# Altium schematic sheet Fan Control Module.SchDoc
size A
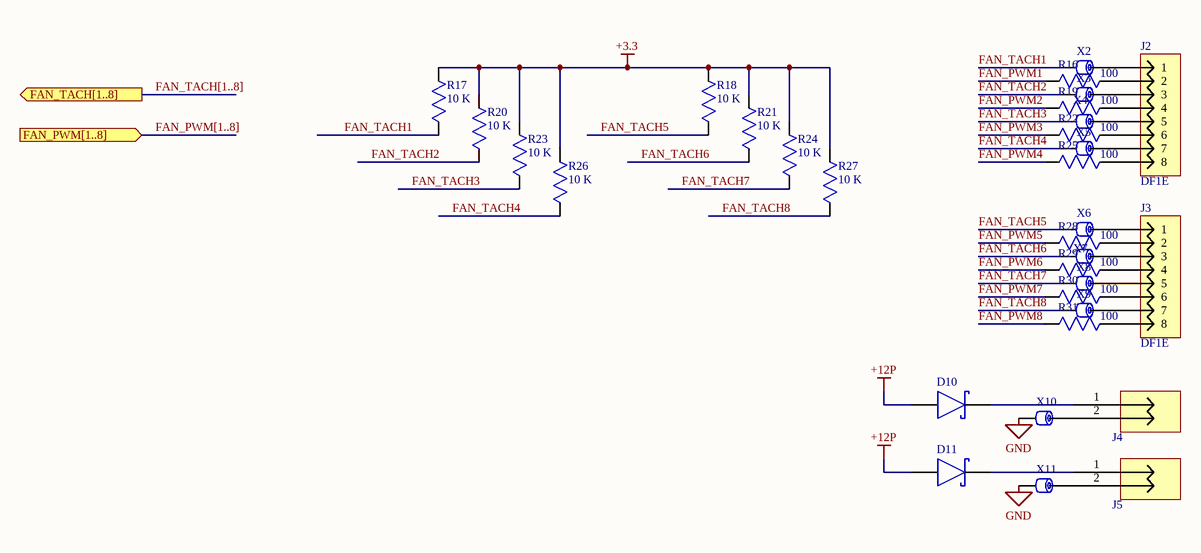
[diagram p0: Fan Control Module.SchDoc]

## Parts
D10  STPS20L15G-TR  [D2PAK-D]  (value not drawn)
D11  STPS20L15G-TR  [D2PAK-D]  (value not drawn)
J2  value DF1E  [DF1EC-8P-2.5DSA]  (hidden comment: DF1E 5-pin Male Header)
J3  value DF1E  [DF1EC-8P-2.5DSA]  (hidden comment: DF1E 5-pin Male Header)
J4  J_PHOENIX_2M_5.08  [PHX2UP]  (value not drawn)
J5  J_PHOENIX_2M_5.08  [PHX2UP]  (value not drawn)
R16  value 100  [0603_res]  (hidden comment: RES 0603)
R17  value 10 K  [0603_res]  (hidden comment: RES 0603)
R18  value 10 K  [0603_res]  (hidden comment: RES 0603)
R19  value 100  [0603_res]  (hidden comment: RES 0603)
R20  value 10 K  [0603_res]  (hidden comment: RES 0603)
R21  value 10 K  [0603_res]  (hidden comment: RES 0603)
R22  value 100  [0603_res]  (hidden comment: RES 0603)
R23  value 10 K  [0603_res]  (hidden comment: RES 0603)
R24  value 10 K  [0603_res]  (hidden comment: RES 0603)
R25  value 100  [0603_res]  (hidden comment: RES 0603)
R26  value 10 K  [0603_res]  (hidden comment: RES 0603)
R27  value 10 K  [0603_res]  (hidden comment: RES 0603)
R28  value 100  [0603_res]  (hidden comment: RES 0603)
R29  value 100  [0603_res]  (hidden comment: RES 0603)
R30  value 100  [0603_res]  (hidden comment: RES 0603)
R31  value 100  [0603_res]  (hidden comment: RES 0603)
X2  0603  [0603_res]  (value not drawn)
X3  0603  [0603_res]  (value not drawn)
X4  0603  [0603_res]  (value not drawn)
X5  0603  [0603_res]  (value not drawn)
X6  0603  [0603_res]  (value not drawn)
X7  0603  [0603_res]  (value not drawn)
X8  0603  [0603_res]  (value not drawn)
X9  0603  [0603_res]  (value not drawn)
X10  Ferrite Bead  [28F0181-1SR-10]  (value not drawn)
X11  Ferrite Bead  [28F0181-1SR-10]  (value not drawn)

## Ports
FAN_PWM[1..8] (in), FAN_TACH[1..8] (out)

## Nets
+3.3: R17.1 R18.1 R20.1 R21.1 R23.1 R24.1 R26.1 R27.1
+12P: D10.A D11.A
GND: X10.1 X11.1
FAN_PWM1: R16.2
FAN_PWM2: R19.2
FAN_PWM3: R22.2
FAN_PWM4: R25.2
FAN_PWM5: R28.2
FAN_PWM6: R29.2
FAN_PWM7: R30.2
FAN_PWM8: R31.2
FAN_TACH1: R17.2 X2.1
FAN_TACH2: R20.2 X3.1
FAN_TACH3: R23.2 X4.1
FAN_TACH4: R26.2 X5.1
FAN_TACH5: R18.2 X6.1
FAN_TACH6: R21.2 X7.1
FAN_TACH7: R24.2 X8.1
FAN_TACH8: R27.2 X9.1
NetD10_K: D10.K J4.1
NetD11_K: D11.K J5.1
NetJ2_1: J2.1 X2.2
NetJ2_2: J2.2 R16.1
NetJ2_3: J2.3 X3.2
NetJ2_4: J2.4 R19.1
NetJ2_5: J2.5 X4.2
NetJ2_6: J2.6 R22.1
NetJ2_7: J2.7 X5.2
NetJ2_8: J2.8 R25.1
NetJ3_1: J3.1 X6.2
NetJ3_2: J3.2 R28.1
NetJ3_3: J3.3 X7.2
NetJ3_4: J3.4 R29.1
NetJ3_5: J3.5 X8.2
NetJ3_6: J3.6 R30.1
NetJ3_7: J3.7 X9.2
NetJ3_8: J3.8 R31.1
NetJ4_2: J4.2 X10.2
NetJ5_2: J5.2 X11.2

## Buses and harness runs
bus FAN_PWM[1..8] = port FAN_PWM[1..8]
bus FAN_TACH[1..8] = port FAN_TACH[1..8]

## Library data of the parts
D10 D11 = D_Schottky_20A_15V_D2PAK: DIODE SCHOTTKY 20A 15V D2PAK; Manufacturer: STMicro; SVP Creator: Jonathan Nutzmann; Known Distributors: Digi-Key; Manufacturer PN: STPS20L15G-TR; Price: 3.49; ComponentLink1Description: Datasheet
J2 J3 = DF1E_8_S: 9-pin Hirose; Manufacturer: Hirose Electric Co Ltd; Manufacturer PN: DF1EC-8P-2.5DSA(05); SVP Creator: Adam Shea; Package: DF1EC-8; Known Distributors: Digikey; HelpURL: http://umnsvp.dyndns.org/svn/centaurus2/datasheets/common%20parts/DF1E.pdf; ComponentLink1URL: http://umnsvp.dyndns.org/svn/centaurus2/datasheets/common%20parts/DF1E.pdf; ComponentLink1Description: Datasheet
J4 J5 = J_PHOENIX_2M_5.08: 2 Pin From Motor
R16-R31 = R_0603: Known Distributors: Digikey; Package: 0603
X2-X9 = X_0603_FERRITE: FERRITE 0603; Known Distributors: Digikey; Package: 0603
X10 X11 = X_FERRITE_10A_3318: FERRITE 10A 115 OHMS SMD; Manufacturer: Laird-Signal Integrity Products; Package: 3318; Known Distributors: Digikey; Manufacturer PN: 28F0181-1SR-10; Current Rating: 10A